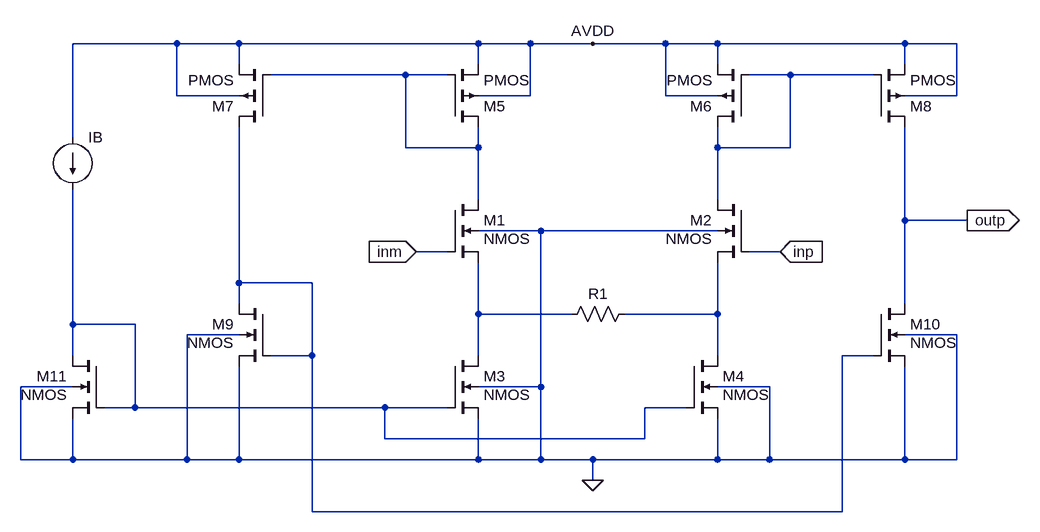
[diagram p0: schematic le_gm.asc]
le_gm.asc, the LTspice schematic file:
Version 4
SHEET 1 1464 740
WIRE -128 0 -288 0
WIRE -32 0 -128 0
WIRE 336 0 -32 0
WIRE 416 0 336 0
WIRE 512 0 416 0
WIRE 624 0 512 0
WIRE 704 0 624 0
WIRE 992 0 704 0
WIRE 1072 0 992 0
WIRE -32 32 -32 0
WIRE 336 32 336 0
WIRE 704 32 704 0
WIRE 992 32 992 0
WIRE 224 48 16 48
WIRE 288 48 224 48
WIRE 816 48 752 48
WIRE 944 48 816 48
WIRE -128 80 -128 0
WIRE -32 80 -128 80
WIRE 416 80 416 0
WIRE 416 80 336 80
WIRE 624 80 624 0
WIRE 704 80 624 80
WIRE 1072 80 1072 0
WIRE 1072 80 992 80
WIRE -288 144 -288 0
WIRE 224 160 224 48
WIRE 336 160 336 128
WIRE 336 160 224 160
WIRE 704 160 704 128
WIRE 816 160 816 48
WIRE 816 160 704 160
WIRE 336 240 336 160
WIRE 704 240 704 160
WIRE 992 272 992 128
WIRE 1088 272 992 272
WIRE 432 288 336 288
WIRE 704 288 432 288
WIRE 288 320 240 320
WIRE 800 320 752 320
WIRE -32 368 -32 128
WIRE 80 368 -32 368
WIRE -32 400 -32 368
WIRE 992 400 992 272
WIRE 336 416 336 336
WIRE 480 416 336 416
WIRE 704 416 704 336
WIRE 704 416 560 416
WIRE -288 432 -288 224
WIRE -192 432 -288 432
WIRE -32 448 -112 448
WIRE 1072 448 992 448
WIRE -288 480 -288 432
WIRE 80 480 80 368
WIRE 80 480 16 480
WIRE 336 480 336 416
WIRE 704 480 704 416
WIRE 944 480 896 480
WIRE -288 528 -368 528
WIRE 432 528 432 288
WIRE 432 528 336 528
WIRE 784 528 704 528
WIRE -192 560 -192 432
WIRE -192 560 -240 560
WIRE 192 560 -192 560
WIRE 288 560 192 560
WIRE 656 560 592 560
WIRE 192 608 192 560
WIRE 592 608 592 560
WIRE 592 608 192 608
WIRE -368 640 -368 528
WIRE -288 640 -288 576
WIRE -288 640 -368 640
WIRE -112 640 -112 448
WIRE -112 640 -288 640
WIRE -32 640 -32 496
WIRE -32 640 -112 640
WIRE 336 640 336 576
WIRE 336 640 -32 640
WIRE 432 640 432 528
WIRE 432 640 336 640
WIRE 512 640 432 640
WIRE 704 640 704 576
WIRE 704 640 512 640
WIRE 784 640 784 528
WIRE 784 640 704 640
WIRE 992 640 992 496
WIRE 992 640 784 640
WIRE 1072 640 1072 448
WIRE 1072 640 992 640
WIRE 512 672 512 640
WIRE 80 720 80 480
WIRE 896 720 896 480
WIRE 896 720 80 720
FLAG 512 672 0
FLAG 240 320 inm
IOPIN 240 320 In
FLAG 800 320 inp
IOPIN 800 320 In
FLAG 1088 272 outp
IOPIN 1088 272 Out
FLAG 512 0 AVDD
SYMBOL nmos4 288 240 R0
WINDOW 3 56 60 Left 2
SYMATTR InstName M1
SYMBOL pmos4 288 128 M180
SYMATTR InstName M5
SYMBOL nmos4 -240 480 M0
WINDOW 3 56 60 Left 2
SYMATTR InstName M11
SYMBOL nmos4 288 480 R0
WINDOW 3 56 60 Left 2
SYMATTR InstName M3
SYMBOL nmos4 656 480 R0
WINDOW 3 56 60 Left 2
SYMATTR InstName M4
SYMBOL res 576 400 R90
WINDOW 0 0 56 VBottom 2
WINDOW 3 32 56 VTop 2
SYMATTR InstName R1
SYMATTR Value ""
SYMBOL current -288 144 R0
SYMATTR InstName IB
SYMATTR Value ""
SYMBOL nmos4 752 240 M0
WINDOW 3 56 60 Left 2
SYMATTR InstName M2
SYMBOL pmos4 752 128 R180
SYMATTR InstName M6
SYMBOL pmos4 16 128 R180
SYMATTR InstName M7
SYMBOL nmos4 16 400 M0
WINDOW 3 56 60 Left 2
SYMATTR InstName M9
SYMBOL pmos4 944 128 M180
SYMATTR InstName M8
SYMBOL nmos4 944 400 R0
WINDOW 3 56 60 Left 2
SYMATTR InstName M10

The netlist it stands for:
* le_gm.asc
M1 N001 inm N004 0 NMOS
M5 N001 N001 AVDD AVDD PMOS
M11 N006 N006 0 0 NMOS
M3 N004 N006 0 0 NMOS
M4 N005 N006 0 0 NMOS
R1 N005 N004
IB AVDD N006
M2 N002 inp N005 0 NMOS
M6 N002 N002 AVDD AVDD PMOS
M7 N003 N001 AVDD AVDD PMOS
M9 N003 N003 0 0 NMOS
M8 outp N002 AVDD AVDD PMOS
M10 outp N003 0 0 NMOS
.model NMOS NMOS
.model PMOS PMOS
.lib standard.mos
.backanno
.end